# Altium schematic sheet VT_BANK.SchDoc
size B; DocumentNumber: 5; SheetNumber: 5; SheetTotal: 13
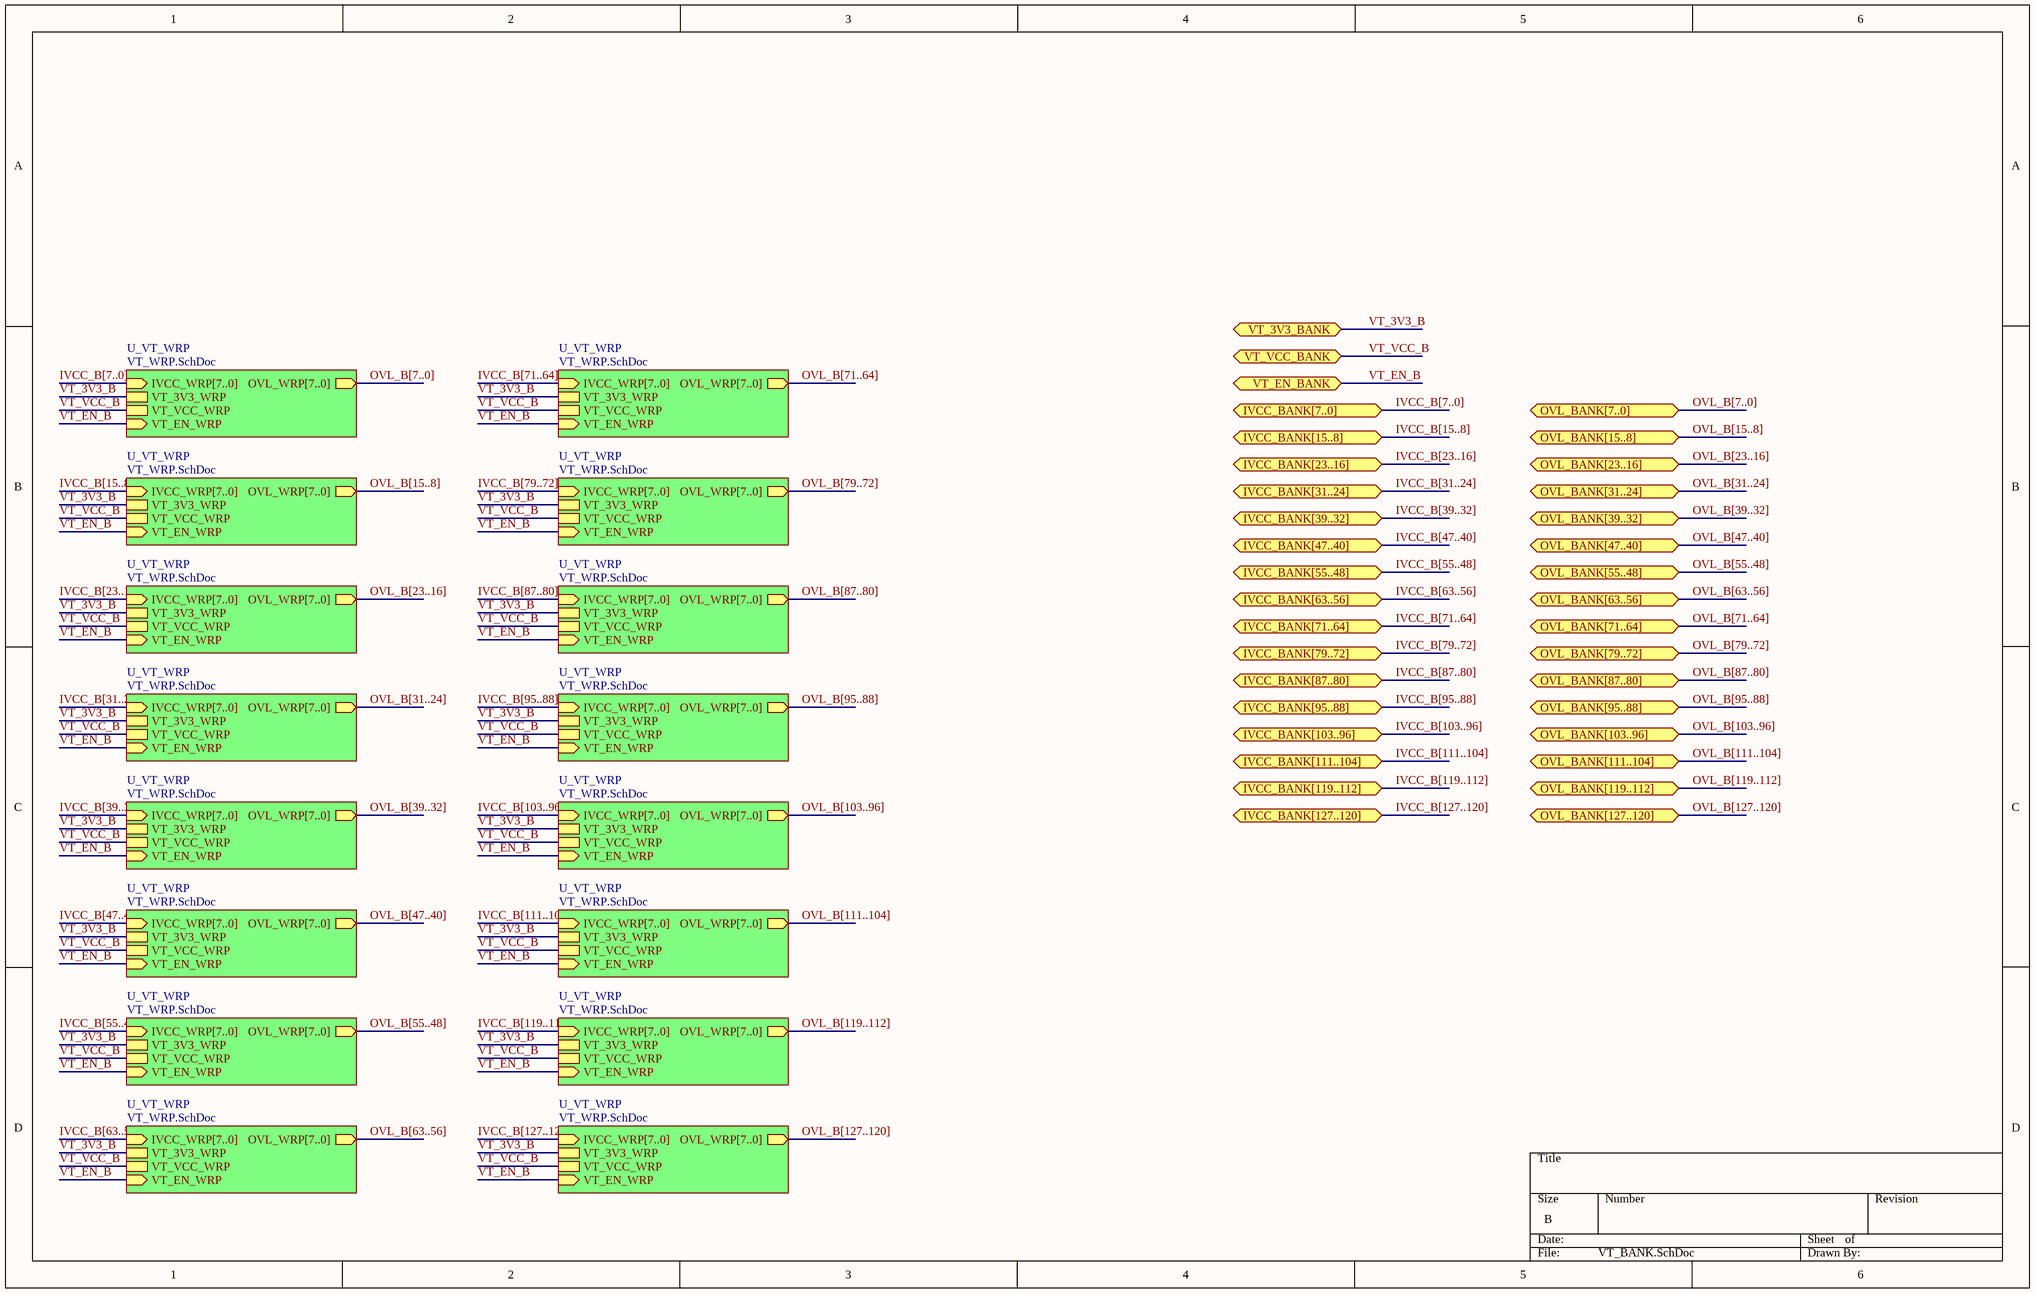
[diagram p0: VT_BANK.SchDoc]

## Sub-sheets
U_VT_WRP = VT_WRP.SchDoc: IVCC_WRP[7..0], OVL_WRP[7..0], VT_3V3_WRP, VT_VCC_WRP, VT_EN_WRP
U_VT_WRP = VT_WRP.SchDoc: IVCC_WRP[7..0], OVL_WRP[7..0], VT_3V3_WRP, VT_VCC_WRP, VT_EN_WRP
U_VT_WRP = VT_WRP.SchDoc: IVCC_WRP[7..0], OVL_WRP[7..0], VT_3V3_WRP, VT_VCC_WRP, VT_EN_WRP
U_VT_WRP = VT_WRP.SchDoc: IVCC_WRP[7..0], OVL_WRP[7..0], VT_3V3_WRP, VT_VCC_WRP, VT_EN_WRP
U_VT_WRP = VT_WRP.SchDoc: IVCC_WRP[7..0], OVL_WRP[7..0], VT_3V3_WRP, VT_VCC_WRP, VT_EN_WRP
U_VT_WRP = VT_WRP.SchDoc: IVCC_WRP[7..0], OVL_WRP[7..0], VT_3V3_WRP, VT_VCC_WRP, VT_EN_WRP
U_VT_WRP = VT_WRP.SchDoc: IVCC_WRP[7..0], OVL_WRP[7..0], VT_3V3_WRP, VT_VCC_WRP, VT_EN_WRP
U_VT_WRP = VT_WRP.SchDoc: IVCC_WRP[7..0], OVL_WRP[7..0], VT_3V3_WRP, VT_VCC_WRP, VT_EN_WRP
U_VT_WRP = VT_WRP.SchDoc: IVCC_WRP[7..0], OVL_WRP[7..0], VT_3V3_WRP, VT_VCC_WRP, VT_EN_WRP
U_VT_WRP = VT_WRP.SchDoc: IVCC_WRP[7..0], OVL_WRP[7..0], VT_3V3_WRP, VT_VCC_WRP, VT_EN_WRP
U_VT_WRP = VT_WRP.SchDoc: IVCC_WRP[7..0], OVL_WRP[7..0], VT_3V3_WRP, VT_VCC_WRP, VT_EN_WRP
U_VT_WRP = VT_WRP.SchDoc: IVCC_WRP[7..0], OVL_WRP[7..0], VT_3V3_WRP, VT_VCC_WRP, VT_EN_WRP
U_VT_WRP = VT_WRP.SchDoc: IVCC_WRP[7..0], OVL_WRP[7..0], VT_3V3_WRP, VT_VCC_WRP, VT_EN_WRP
U_VT_WRP = VT_WRP.SchDoc: IVCC_WRP[7..0], OVL_WRP[7..0], VT_3V3_WRP, VT_VCC_WRP, VT_EN_WRP
U_VT_WRP = VT_WRP.SchDoc: IVCC_WRP[7..0], OVL_WRP[7..0], VT_3V3_WRP, VT_VCC_WRP, VT_EN_WRP
U_VT_WRP = VT_WRP.SchDoc: IVCC_WRP[7..0], OVL_WRP[7..0], VT_3V3_WRP, VT_VCC_WRP, VT_EN_WRP

## Ports
IVCC_BANK[7..0], IVCC_BANK[15..8], IVCC_BANK[23..16], IVCC_BANK[31..24], IVCC_BANK[39..32], IVCC_BANK[47..40], IVCC_BANK[55..48], IVCC_BANK[63..56], IVCC_BANK[71..64], IVCC_BANK[79..72], IVCC_BANK[87..80], IVCC_BANK[95..88], IVCC_BANK[103..96], IVCC_BANK[111..104], IVCC_BANK[119..112], IVCC_BANK[127..120], OVL_BANK[7..0], OVL_BANK[15..8], OVL_BANK[23..16], OVL_BANK[31..24], OVL_BANK[39..32], OVL_BANK[47..40], OVL_BANK[55..48], OVL_BANK[63..56], OVL_BANK[71..64], OVL_BANK[79..72], OVL_BANK[87..80], OVL_BANK[95..88], OVL_BANK[103..96], OVL_BANK[111..104], OVL_BANK[119..112], OVL_BANK[127..120], VT_3V3_BANK, VT_EN_BANK, VT_VCC_BANK

## Nets
VT_3V3_B: port VT_3V3_BANK, sheet U_VT_WRP/VT_3V3_WRP, sheet U_VT_WRP/VT_3V3_WRP, sheet U_VT_WRP/VT_3V3_WRP, sheet U_VT_WRP/VT_3V3_WRP, sheet U_VT_WRP/VT_3V3_WRP, sheet U_VT_WRP/VT_3V3_WRP, sheet U_VT_WRP/VT_3V3_WRP, sheet U_VT_WRP/VT_3V3_WRP, sheet U_VT_WRP/VT_3V3_WRP, sheet U_VT_WRP/VT_3V3_WRP, sheet U_VT_WRP/VT_3V3_WRP, sheet U_VT_WRP/VT_3V3_WRP, sheet U_VT_WRP/VT_3V3_WRP, sheet U_VT_WRP/VT_3V3_WRP, sheet U_VT_WRP/VT_3V3_WRP, sheet U_VT_WRP/VT_3V3_WRP
VT_EN_B: port VT_EN_BANK, sheet U_VT_WRP/VT_EN_WRP, sheet U_VT_WRP/VT_EN_WRP, sheet U_VT_WRP/VT_EN_WRP, sheet U_VT_WRP/VT_EN_WRP, sheet U_VT_WRP/VT_EN_WRP, sheet U_VT_WRP/VT_EN_WRP, sheet U_VT_WRP/VT_EN_WRP, sheet U_VT_WRP/VT_EN_WRP, sheet U_VT_WRP/VT_EN_WRP, sheet U_VT_WRP/VT_EN_WRP, sheet U_VT_WRP/VT_EN_WRP, sheet U_VT_WRP/VT_EN_WRP, sheet U_VT_WRP/VT_EN_WRP, sheet U_VT_WRP/VT_EN_WRP, sheet U_VT_WRP/VT_EN_WRP, sheet U_VT_WRP/VT_EN_WRP
VT_VCC_B: port VT_VCC_BANK, sheet U_VT_WRP/VT_VCC_WRP, sheet U_VT_WRP/VT_VCC_WRP, sheet U_VT_WRP/VT_VCC_WRP, sheet U_VT_WRP/VT_VCC_WRP, sheet U_VT_WRP/VT_VCC_WRP, sheet U_VT_WRP/VT_VCC_WRP, sheet U_VT_WRP/VT_VCC_WRP, sheet U_VT_WRP/VT_VCC_WRP, sheet U_VT_WRP/VT_VCC_WRP, sheet U_VT_WRP/VT_VCC_WRP, sheet U_VT_WRP/VT_VCC_WRP, sheet U_VT_WRP/VT_VCC_WRP, sheet U_VT_WRP/VT_VCC_WRP, sheet U_VT_WRP/VT_VCC_WRP, sheet U_VT_WRP/VT_VCC_WRP, sheet U_VT_WRP/VT_VCC_WRP

## Buses and harness runs
bus IVCC_B[7..0] = port IVCC_BANK[7..0]
bus IVCC_B[7..0] = sheet U_VT_WRP/IVCC_WRP[7..0]
bus IVCC_B[15..8] = port IVCC_BANK[15..8]
bus IVCC_B[15..8] = sheet U_VT_WRP/IVCC_WRP[7..0]
bus IVCC_B[23..16] = port IVCC_BANK[23..16]
bus IVCC_B[23..16] = sheet U_VT_WRP/IVCC_WRP[7..0]
bus IVCC_B[31..24] = port IVCC_BANK[31..24]
bus IVCC_B[31..24] = sheet U_VT_WRP/IVCC_WRP[7..0]
bus IVCC_B[39..32] = port IVCC_BANK[39..32]
bus IVCC_B[39..32] = sheet U_VT_WRP/IVCC_WRP[7..0]
bus IVCC_B[47..40] = port IVCC_BANK[47..40]
bus IVCC_B[47..40] = sheet U_VT_WRP/IVCC_WRP[7..0]
bus IVCC_B[55..48] = port IVCC_BANK[55..48]
bus IVCC_B[55..48] = sheet U_VT_WRP/IVCC_WRP[7..0]
bus IVCC_B[63..56] = port IVCC_BANK[63..56]
bus IVCC_B[63..56] = sheet U_VT_WRP/IVCC_WRP[7..0]
bus IVCC_B[71..64] = port IVCC_BANK[71..64]
bus IVCC_B[71..64] = sheet U_VT_WRP/IVCC_WRP[7..0]
bus IVCC_B[79..72] = port IVCC_BANK[79..72]
bus IVCC_B[79..72] = sheet U_VT_WRP/IVCC_WRP[7..0]
bus IVCC_B[87..80] = port IVCC_BANK[87..80]
bus IVCC_B[87..80] = sheet U_VT_WRP/IVCC_WRP[7..0]
bus IVCC_B[95..88] = port IVCC_BANK[95..88]
bus IVCC_B[95..88] = sheet U_VT_WRP/IVCC_WRP[7..0]
bus IVCC_B[103..96] = port IVCC_BANK[103..96]
bus IVCC_B[103..96] = sheet U_VT_WRP/IVCC_WRP[7..0]
bus IVCC_B[111..104] = port IVCC_BANK[111..104]
bus IVCC_B[111..104] = sheet U_VT_WRP/IVCC_WRP[7..0]
bus IVCC_B[119..112] = port IVCC_BANK[119..112]
bus IVCC_B[119..112] = sheet U_VT_WRP/IVCC_WRP[7..0]
bus IVCC_B[127..120] = port IVCC_BANK[127..120]
bus IVCC_B[127..120] = sheet U_VT_WRP/IVCC_WRP[7..0]
bus OVL_B[7..0] = port OVL_BANK[7..0]
bus OVL_B[7..0] = sheet U_VT_WRP/OVL_WRP[7..0]
bus OVL_B[15..8] = port OVL_BANK[15..8]
bus OVL_B[15..8] = sheet U_VT_WRP/OVL_WRP[7..0]
bus OVL_B[23..16] = port OVL_BANK[23..16]
bus OVL_B[23..16] = sheet U_VT_WRP/OVL_WRP[7..0]
bus OVL_B[31..24] = port OVL_BANK[31..24]
bus OVL_B[31..24] = sheet U_VT_WRP/OVL_WRP[7..0]
bus OVL_B[39..32] = port OVL_BANK[39..32]
bus OVL_B[39..32] = sheet U_VT_WRP/OVL_WRP[7..0]
bus OVL_B[47..40] = port OVL_BANK[47..40]
bus OVL_B[47..40] = sheet U_VT_WRP/OVL_WRP[7..0]
bus OVL_B[55..48] = port OVL_BANK[55..48]
bus OVL_B[55..48] = sheet U_VT_WRP/OVL_WRP[7..0]
bus OVL_B[63..56] = port OVL_BANK[63..56]
bus OVL_B[63..56] = sheet U_VT_WRP/OVL_WRP[7..0]
bus OVL_B[71..64] = port OVL_BANK[71..64]
bus OVL_B[71..64] = sheet U_VT_WRP/OVL_WRP[7..0]
bus OVL_B[79..72] = port OVL_BANK[79..72]
bus OVL_B[79..72] = sheet U_VT_WRP/OVL_WRP[7..0]
bus OVL_B[87..80] = port OVL_BANK[87..80]
bus OVL_B[87..80] = sheet U_VT_WRP/OVL_WRP[7..0]
bus OVL_B[95..88] = port OVL_BANK[95..88]
bus OVL_B[95..88] = sheet U_VT_WRP/OVL_WRP[7..0]
bus OVL_B[103..96] = port OVL_BANK[103..96]
bus OVL_B[103..96] = sheet U_VT_WRP/OVL_WRP[7..0]
bus OVL_B[111..104] = port OVL_BANK[111..104]
bus OVL_B[111..104] = sheet U_VT_WRP/OVL_WRP[7..0]
bus OVL_B[119..112] = port OVL_BANK[119..112]
bus OVL_B[119..112] = sheet U_VT_WRP/OVL_WRP[7..0]
bus OVL_B[127..120] = port OVL_BANK[127..120]
bus OVL_B[127..120] = sheet U_VT_WRP/OVL_WRP[7..0]